# EAGLE design ir_dual (EAGLE 6.1)
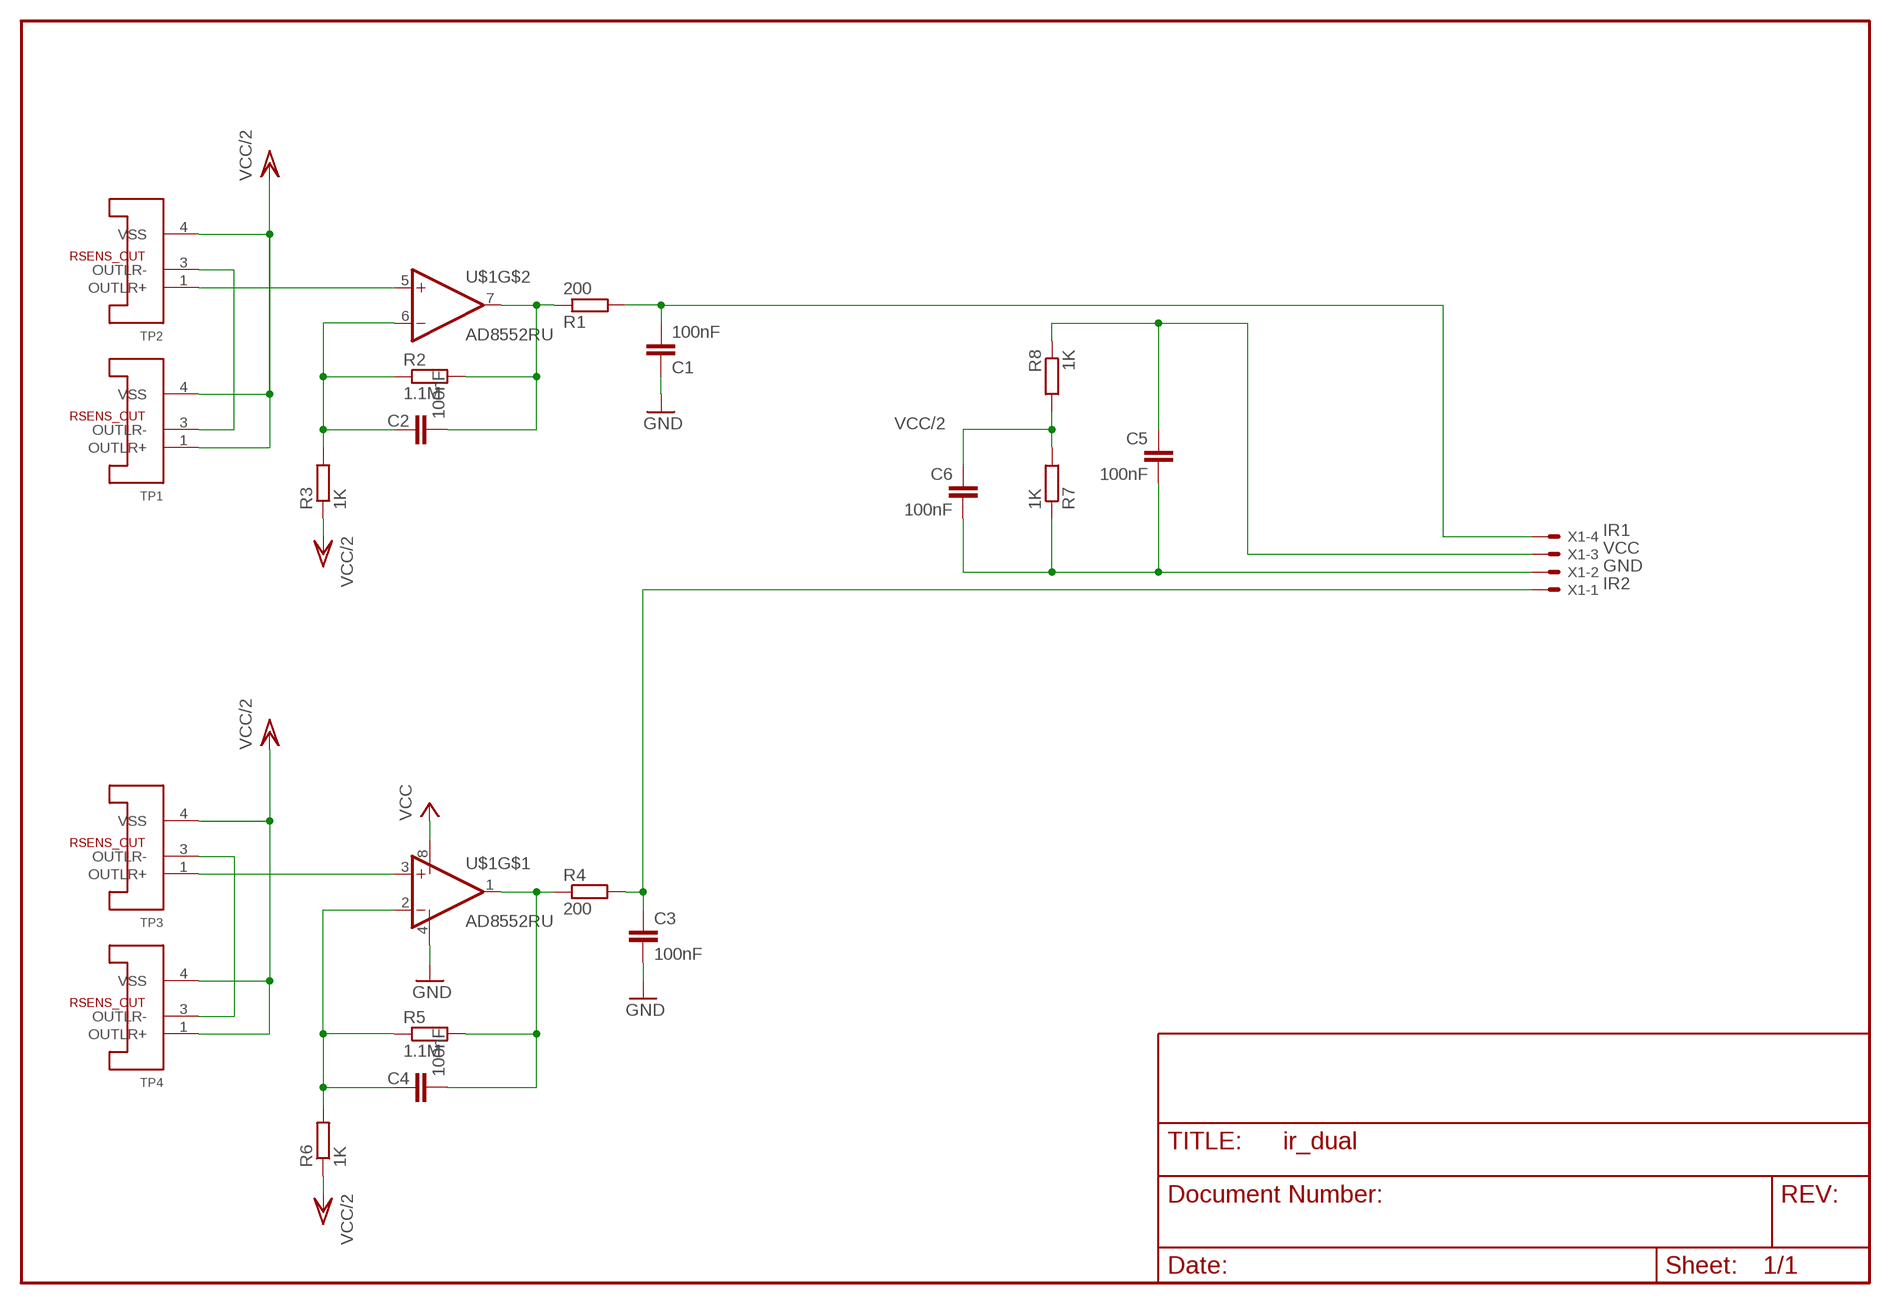
[diagram p0: schematic, sheet 1]

## Parts
C1  100nF  C-EUC0603  [C0603]
C2  100nF  C-EUC0603  [C0603]
C3  100nF  C-EUC0603  [C0603]
C4  100nF  C-EUC0603  [C0603]
C5  100nF  C-EUC0603  [C0603]
C6  100nF  C-EUC0603  [C0603]
R1  200  R-EU_R0603  [R0603]
R2  1.1M  R-EU_R0603  [R0603]
R3  1K  R-EU_R0603  [R0603]
R4  200  R-EU_R0603  [R0603]
R5  1.1M  R-EU_R0603  [R0603]
R6  1K  R-EU_R0603  [R0603]
R7  1K  R-EU_R0603  [R0603]
R8  1K  R-EU_R0603  [R0603]
TP1  MLX90247  [TO39H]
TP2  MLX90247  [TO39H]
TP3  MLX90247  [TO39H]
TP4  MLX90247  [TO39H]
U$1  AD8552RU  [TSSOP8]
X1  53048-04  [53048-04]

## Nets
GND: C1.1 C3.2 C5.2 C6.2 R7.1 U$1.4(V-) X1.2
IR1: C1.2 R1.2 X1.4
IR2: C3.1 R4.2 X1.1
N$1: TP1.3(OUTLR-) TP2.3(OUTLR-)
N$2: TP3.3(OUTLR-) TP4.3(OUTLR-)
N$3: TP2.1(OUTLR+) U$1.5(+IN)
N$6: C2.2 R1.1 R2.2 U$1.7(OUT)
N$7: C2.1 R2.1 R3.2 U$1.6(-IN)
N$8: C4.2 R4.1 R5.2 U$1.1(OUT)
N$11: TP3.1(OUTLR+) U$1.3(+IN)
N$125: C4.1 R5.1 R6.2 U$1.2(-IN)
VCC: C5.1 R8.1 U$1.8(V+) X1.3
VCC/2: C6.1 R3.1 R6.1 R7.2 R8.2 TP1.1(OUTLR+) TP1.4(VSS) TP2.4(VSS) TP3.4(VSS) TP4.1(OUTLR+) TP4.4(VSS)

## Library data of the parts
C1-C6 = rcl:C-EU: CAPACITOR, European symbol
R1-R8 = rcl:R-EU_: RESISTOR, European symbol
TP1-TP4 = paparazzi:MLX90247
U$1 = paparazzi:AD8552
X1 = con-molex:53?-04: CONNECTOR wire to board 1.25 mm (.049 inch) pitch header

## Board
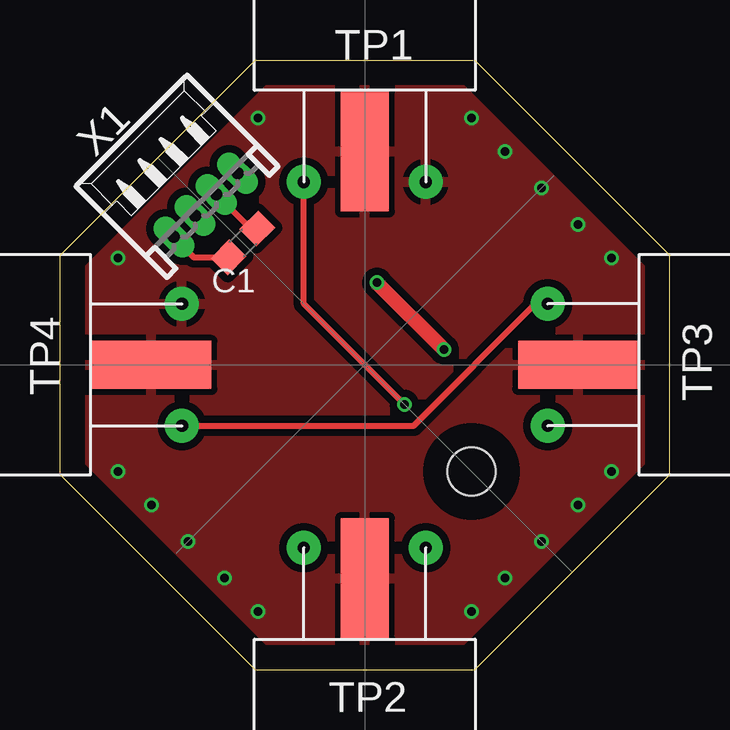
[diagram p1: board, top side]
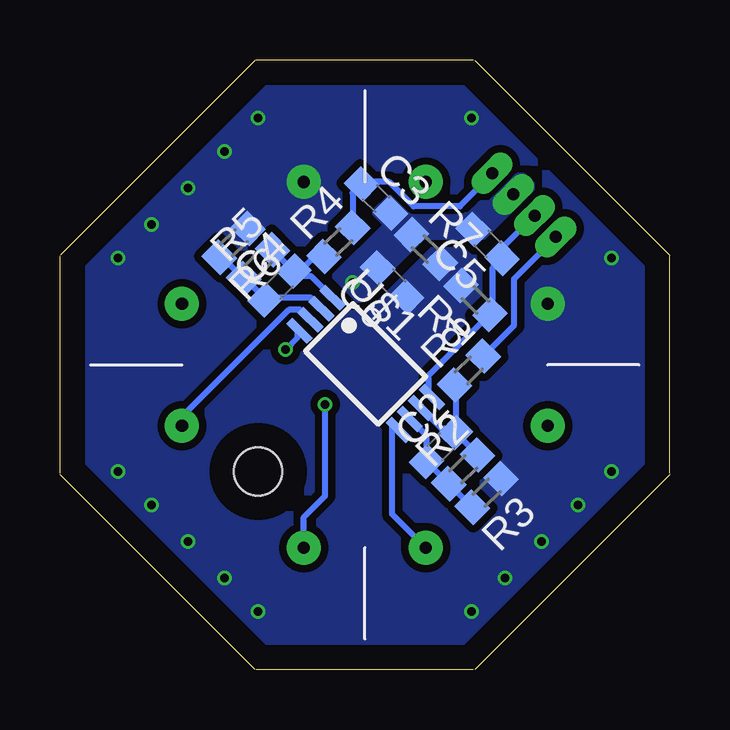
[diagram p2: board, bottom side, seen from below]

Size 25.4 x 25.4 mm. Coordinates in mm from the lower left corner, seen from the top.
Outline: 0,8.13 8.13,0
Outline: 17.27,0 25.4,8.13
Outline: 17.27,25.4 25.4,17.27
Outline: 8.13,25.4 0,17.27
Outline: 8.18,0 17.22,0
Outline: 8.18,25.4 17.22,25.4
Outline: 25.4,8.18 25.4,17.22
Outline: 0,8.18 0,17.22
Copper layers (1*16): Top 0.035mm / dielectric 1.5mm / Bottom 0.035mm
Design rules: minimum track width 0.2mm, minimum drill 0.35mm, track to track 0.2mm, track to pad 0.2mm, pad to pad 0.2mm, via to via 0.2mm, smd to smd 0.2mm, copper to edge 40mil, drill to drill 8mil, minimum pad ring 10mil, minimum via ring 5mil, stop-mask expansion 4mil, vias tented up to drill 0mil, thermal gap 10mil
Holes 2 mm at 17.15,8.25

### Footprints (pad centres in the part's own frame; a part is rotated, then mirrored left to right if it is on the bottom)
C0603 = smd 1.1 x 1: 1 -0.85,0; 2 0.85,0
R0603 = smd 1 x 1.1: 1 -0.85,0; 2 0.85,0
TO39H = drill 0.508 pad 1.422: 1 2.54,-3.81; 3 -2.54,-3.81 | smd 2 x 5: 4 0,-2.54
TSSOP8 = smd 0.35 x 1.2: 1 -0.975,-2.925; 2 -0.325,-2.925; 3 0.325,-2.925; 4 0.975,-2.925; 5 0.975,2.925; 6 0.325,2.925; 7 -0.325,2.925; 8 -0.975,2.925
53048-04 = drill 0.5 pad 0.698 long: 1 1.875,-1.25; 2 0.625,-1.25; 3 -0.625,-1.25; 4 -1.875,-1.25

### Placement (x,y rotation side)
C1  7.62,17.78 225 top
C2  9.53,9.27 45 bottom
C3  12.23,19.63 315 bottom
C4  16.26,16 45 bottom
C5  7.58,17.74 135 bottom
C6  11.56,16.13 135 bottom
R1  8.37,12.46 45 bottom
R2  8.6,8.34 45 bottom
R3  7.62,7.37 225 bottom
R4  13.81,17.82 45 bottom
R5  17.15,16.89 45 bottom
R6  18.16,17.78 225 bottom
R7  10.16,17.53 315 bottom
R8  8.09,15.4 135 bottom
TP1  12.7,24.13 0 top
TP2  12.7,1.27 180 top
TP3  24.13,12.7 270 top
TP4  1.27,12.7 90 top
U$1  12.66,12.74 225 bottom
X1  5.19,20.24 45 top

### Tracks (layer width: path | path; a pad name or v marks a point on that pad's centre or on a via)
GND  (via drill 0.35)
  Top 0.254: X1.2 6.5,19.81 | X1.2 | 7.91,18.38 7.91,18.41 X1.2
  Top 0.406: 7.91,18.38 C1.1
  Top 0.61: v16,13.33 v13.21,16.13
  Bottom 0.254: 15.49,14.19 15.49,14.22 | 15.49,14.19 U$1.4 | v16,13.33 15.49,13.84 15.49,14.19
  pour Bottom (no thermals): 6.1,20.57 6.35,20.57 7.49,19.43 7.87,19.43 8.38,18.92 10.92,18.92 11.68,19.69 12.32,19.05 11.81,18.54 13.97,16.38 12.95,15.37 10.29,18.03 7.75,18.03 5.71,20.07 5.71,20.19
IR1
  Top 0.254: 6.99,17.27 6.99,17.21 C1.2 5.58,17.18 4.73,18.03 | 4.73,18.03 4.72,18.03 | X1.4 4.73,18.03
  Bottom 0.254: R1.2 6.48,14.35 6.48,16.28 4.73,18.03 | 4.73,18.03 4.72,18.03 | 4.73,18.03 X1.4
IR2
  Bottom 0.254: R4.2 13.21,19.85 C3.1 12.92,20.32 | 12.92,20.32 12.95,20.32 | 12.92,20.32 11.68,20.32 10.67,19.3 8.74,19.3 7.4,20.64 X1.1
N$1  (via drill 0.35)
  Top 0.254: TP1.3 10.16,15.24 v14.35,11.05
  Bottom 0.254: TP2.3 15.24,6.35 14.35,7.24 v14.35,11.05
N$2
  Top 0.254: TP3.3 19.81,15.24 14.73,10.16 TP4.3
N$3
  Bottom 0.254: U$1.5 11.56,10.25 11.56,10.29 11.56,6.48 TP2.1
N$6
  Bottom 0.254: C2.2 9.02,9.96 9.02,10.03 9.5,10.03 U$1.7 | R1.1 8.92,11.81 8.89,11.81 8.89,9.91 | C2.2 8.89,9.91 | C2.2 8.89,9.91 | R2.2 8.89,9.84 8.89,9.91
N$7
  Bottom 0.254: R3.2 9.08,7.62 9.14,7.62 9.14,7.69 R2.1 10.09,8.64 10.16,8.64 C2.1 10.13,9.74 10.79,10.41 U$1.6
N$8
  Bottom 0.254: U$1.1 14.93,16.38 15.37,16.38 | 15.37,16.38 15.49,16.38 15.49,16.44 C4.2 16.45,17.4 | 16.45,17.4 16.51,17.4 16.45,17.4 | 16.45,17.4 R5.2 | 15.37,16.38 15.37,16.64 14.79,17.22 R4.1
N$11
  Bottom 0.254: U$1.3 15.37,14.99 15.88,14.99 20.32,10.54 TP3.1
N$125
  Bottom 0.254: R6.2 18.67,17.09 18.67,17.14 18.6,17.14 R5.1 17.78,16.26 17.65,16.26 16.89,15.49 | 16.89,15.49 16.89,15.44 C4.1 | U$1.2 14.96,15.49 16.89,15.49
VCC
  Bottom 0.254: C5.1 6.99,17.02 | C5.1 7.37,16.76 7.37,14.86 7.43,14.86 R8.1 10.03,12.26 10.03,11.49 U$1.8 | X1.3 6.99,17.55 C5.1
VCC/2  (via drill 0.35)
  other vias: 20.07,20.07 5.33,5.33 20.07,5.33 22.99,8.25 21.59,6.86 17.15,2.41 8.26,2.41 2.41,8.25 2.41,17.14 8.26,22.99 17.15,22.99 22.99,17.14 3.81,6.86 21.59,18.54 18.54,3.81 18.54,21.59 6.86,3.81
  pour Top (isolate 0.305): 0,17.27 8.13,25.4 17.27,25.4 25.4,17.27 25.4,8.13 17.27,0 8.13,0 0,8.13
  pour Bottom (isolate 0.305, rank 2, no thermals): 8.13,25.4 17.27,25.4 25.4,17.27 25.4,8.13 17.27,0 8.13,0 0,8.13 0,17.27

### Text on the board
tDocu: Paparazzi | ir double v1.1